# EAGLE design Load_cell_1_0 (EAGLE 6.6.0)
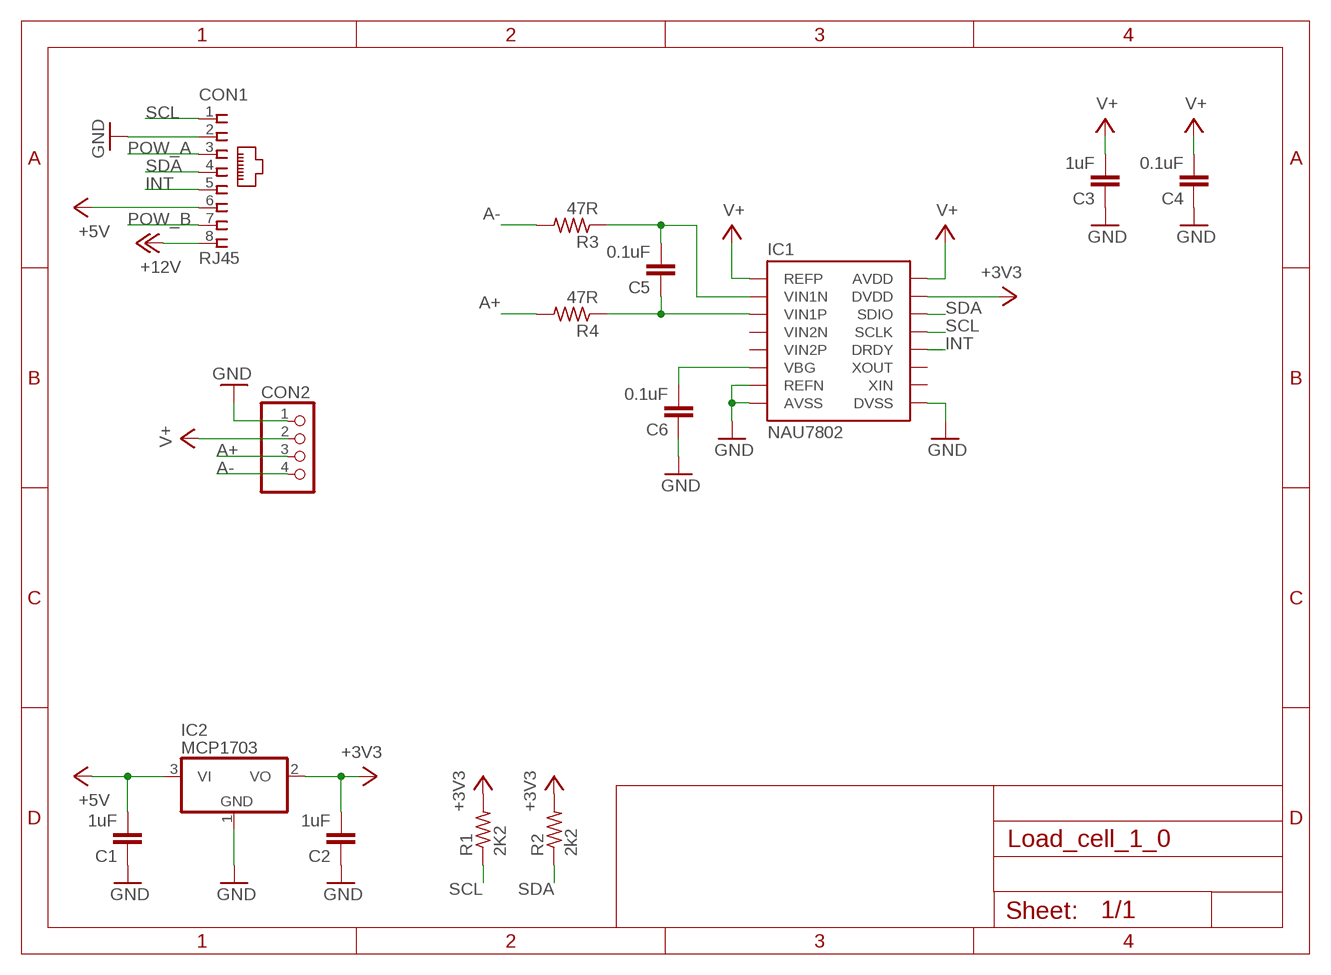
[diagram p0: schematic, sheet 1]

## Parts
C1  1uF  C-EUC0603K  [C0603K]
C2  1uF  C-EUC0603K  [C0603K]
C3  1uF  C-EUC0603K  [C0603K]
C4  0.1uF  C-EUC0603K  [C0603K]
C5  0.1uF  C-EUC0603K  [C0603K]
C6  0.1uF  C-EUC0603K  [C0603K]
CON1  RJ45  RJ45VERTICAL  [RJ45-NO-SHIELD-VERTICAL]
CON2  PINHD-1X4  [1X04]
IC1  NAU7802  NAU7802SOIC  [SO16]
IC2  MCP1703  MCP1703CB  [SOT23]
R1  2K2  R-US_R0603  [R0603]
R2  2k2  R-US_R0603  [R0603]
R3  47R  R-US_R0603  [R0603]
R4  47R  R-US_R0603  [R0603]

## Nets
+3V3: C2.2 IC1.15(DVDD) IC2.2(VO) R1.2 R2.2
+5V: C1.2 CON1.6 IC2.3(VI)
+12V: CON1.8
A+: CON2.3 R4.2
A-: CON2.4 R3.2
GND: C1.1 C2.1 C3.1 C4.1 C6.1 CON1.2 CON2.1 IC1.7(REFN) IC1.8(AVSS) IC1.9(DVSS) IC2.1(GND)
INT: CON1.5 IC1.12(DRDY)
N$1: C5.2 IC1.2(VIN1N) R3.1
N$2: C5.1 IC1.3(VIN1P) R4.1
N$3: C6.2 IC1.6(VBG)
POW_A: CON1.3
POW_B: CON1.7
SCL: CON1.1 IC1.13(SCLK) R1.1
SDA: CON1.4 IC1.14(SDIO) R2.1
V+: C3.2 C4.2 CON2.2 IC1.1(REFP) IC1.16(AVDD)
Unconnected: IC1.4(VIN2N) IC1.5(VIN2P) IC1.10(XIN) IC1.11(XOUT)

## Library data of the parts
C1-C6 = rcl:C-EU: CAPACITOR, European symbol
CON1 = con-tycoelectronics-vertical_RJ45:RJ45: CORCOM Modular RJ Jacks No Shield Source: www.tycoelectronics.com .. ENG_DS_1654001_1099_RJ_L_0507.pdf
CON2 = pinhead:PINHD-1X4: PIN HEADER
IC1 = SparkFun-IC-Conversion:NAU7802: 24-bit load cell conversion IC with I2C interface in SOIC-16 package. Similar to HX711 but with true I2C interface.; PROD_ID: IC-14299
IC2 = linear:MCP1703: 250 mA, 16V, Low Quiescent Current LDO Regulator Source: http://ww1.microchip.com/downloads/en/DeviceDoc/22049b.pdf
R1-R4 = resistor:R-US_: RESISTOR, American symbol

## Board
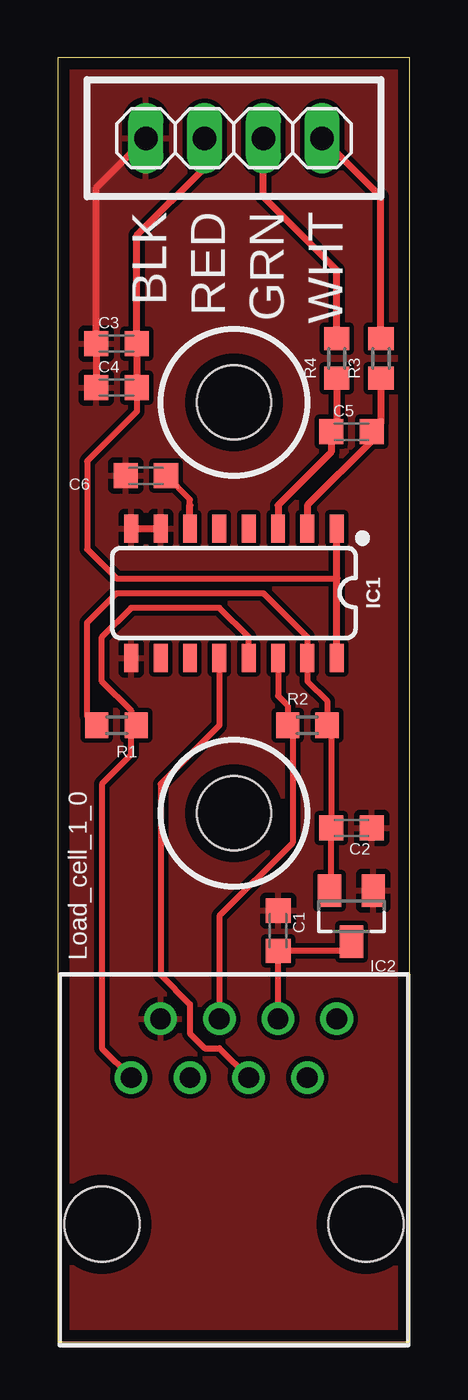
[diagram p1: board, top side]
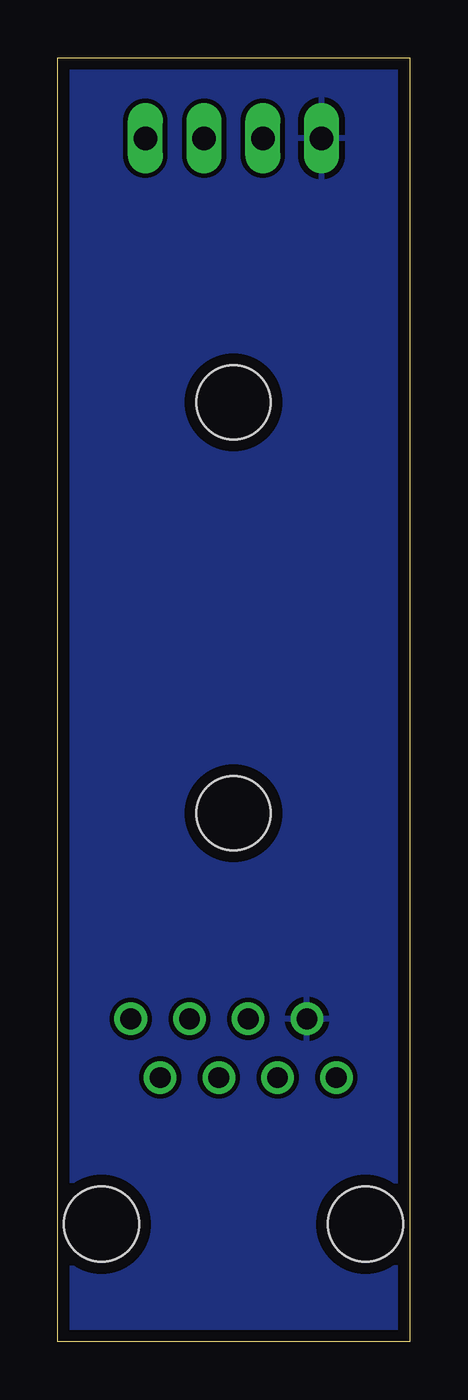
[diagram p2: board, bottom side, seen from below]

Size 15.22 x 55.55 mm. Coordinates in mm from the lower left corner, seen from the top.
Outline: 0,0 15.22,0 15.22,55.55 0,55.55 0,0
Copper layers (1*16): Top 0.035mm / dielectric 1.5mm / Bottom 0.035mm
Design rules "default *": minimum track width 10mil, minimum drill 24mil, track to track 8mil, track to pad 8mil, pad to pad 8mil, via to via 8mil, smd to smd 8mil, copper to edge 20mil, drill to drill 8mil, minimum pad ring 10mil, minimum via ring 8mil, stop-mask expansion 4mil, vias tented up to drill 0mil, thermal gap 10mil
Holes 3.2 mm at 7.62,40.64 7.62,22.86

### Footprints (pad centres in the part's own frame; a part is rotated, then mirrored left to right if it is on the bottom)
C0603K = smd 1.05 x 1.08: 1 -0.875,0; 2 0.875,0
RJ45-NO-SHIELD-VERTICAL = drill 0.9 pad 1.4: 1 -4.445,5.08; 2 -3.175,7.62; 3 -1.905,5.08; 4 -0.635,7.62; 5 0.635,5.08; 6 1.905,7.62; 7 3.175,5.08; 8 4.445,7.62 | hole 3.251: -5.715,-1.27; 5.715,-1.27
1X04 = drill 1.016 long: 1 -3.81,0; 2 -1.27,0; 3 1.27,0; 4 3.81,0
SO16 = smd 0.6 x 1.2: 1 -4.445,-2.8; 2 -3.175,-2.8; 3 -1.905,-2.8; 4 -0.635,-2.8; 5 0.635,-2.8; 6 1.905,-2.8; 7 3.175,-2.8; 8 4.445,-2.8; 9 4.445,2.8; 10 3.175,2.8; 11 1.905,2.8; 12 0.635,2.8; 13 -0.635,2.8; 14 -1.905,2.8; 15 -3.175,2.8; 16 -4.445,2.8
SOT23 = smd 1 x 1.4: 1 -0.95,-1.1; 2 0.95,-1.1; 3 0,1.1
R0603 = smd 1 x 1.1: 1 -0.85,0; 2 0.85,0

### Placement (x,y rotation side)
C1  9.53,17.78 270 top
C2  12.7,22.23 180 top
C3  2.54,43.18 0 top
C4  2.54,41.27 0 top
C5  12.7,39.37 0 top
C6  3.81,37.47 0 top
CON1  7.62,6.35 0 top
CON2  7.62,52.07 0 top
IC1  7.62,32.38 180 top
IC2  12.7,18.41 180 top
R1  2.54,26.67 180 top
R2  10.79,26.67 0 top
R3  13.97,42.55 90 top
R4  12.06,42.55 90 top

### Tracks (layer width: path | path; a pad name or v marks a point on that pad's centre or on a via)
+3V3
  Top 0.254: IC2.2 11.82,19.59 C2.2 11.82,26.49 R2.2 11.64,27.73 10.79,28.57 IC1.15 10.79,30.48 8.89,32.38 2.54,32.38 1.27,31.11 1.27,27.09 R1.2
+5V
  Top 0.254: CON1.6 C1.2 12.29,16.91 IC2.3
A+
  Top 0.305: R4.2 12.06,46.35 8.89,49.53 CON2.3
A-
  Top 0.305: R3.2 13.97,49.53 CON2.4
GND
  Top 0.305: CON2.1 1.67,49.92 C3.1 C4.1 | IC1.8 IC1.7
  pour Top: 0,0 0,55.88 15.24,55.88 15.24,0
  pour Bottom: 0,0 0,55.88 15.24,55.88 15.24,0
INT
  Top 0.254: IC1.12 6.99,26.67 4.45,24.13 4.45,15.88 5.71,14.61 5.71,13.34 6.35,12.7 6.99,12.7 CON1.5
N$1
  Top 0.305: R3.1 13.97,39.77 C5.2 13.57,38.98 10.79,36.2 IC1.2
N$2
  Top 0.305: R4.1 12.06,39.61 C5.1 11.82,38.49 9.53,36.2 IC1.3
N$3
  Top 0.254: 5.71,36.2 5.71,36.44 C6.2
  Top 0.305: IC1.6 5.71,36.2
SCL
  Top 0.254: IC1.13 8.26,30.48 6.99,31.75 3.17,31.75 1.91,30.48 1.91,28.57 3.17,27.3 3.17,26.89 R1.1 3.17,26.45 3.17,25.4 1.91,24.13 1.91,12.7 CON1.1
SDA
  Top 0.254: IC1.14 9.53,27.94 9.95,27.52 R2.1 10.16,26.45 10.16,21.59 6.99,18.41 CON1.4
V+
  Top 0.254: C4.2 3.42,40.24 1.27,38.1 1.27,34.29 2.54,33.02 12.06,33.02
  Top 0.305: CON2.2 6.35,50.8 3.42,47.87 C3.2 C4.2 | IC1.16 12.06,33.02 IC1.1

### Text on the board
tPlace: BLK | RED | GRN | WHT | Load_cell_1_0